# Altium schematic sheet Shutdown.SchDoc
size 381 x 254 mm; SheetNumber: 1; SheetTotal: 1
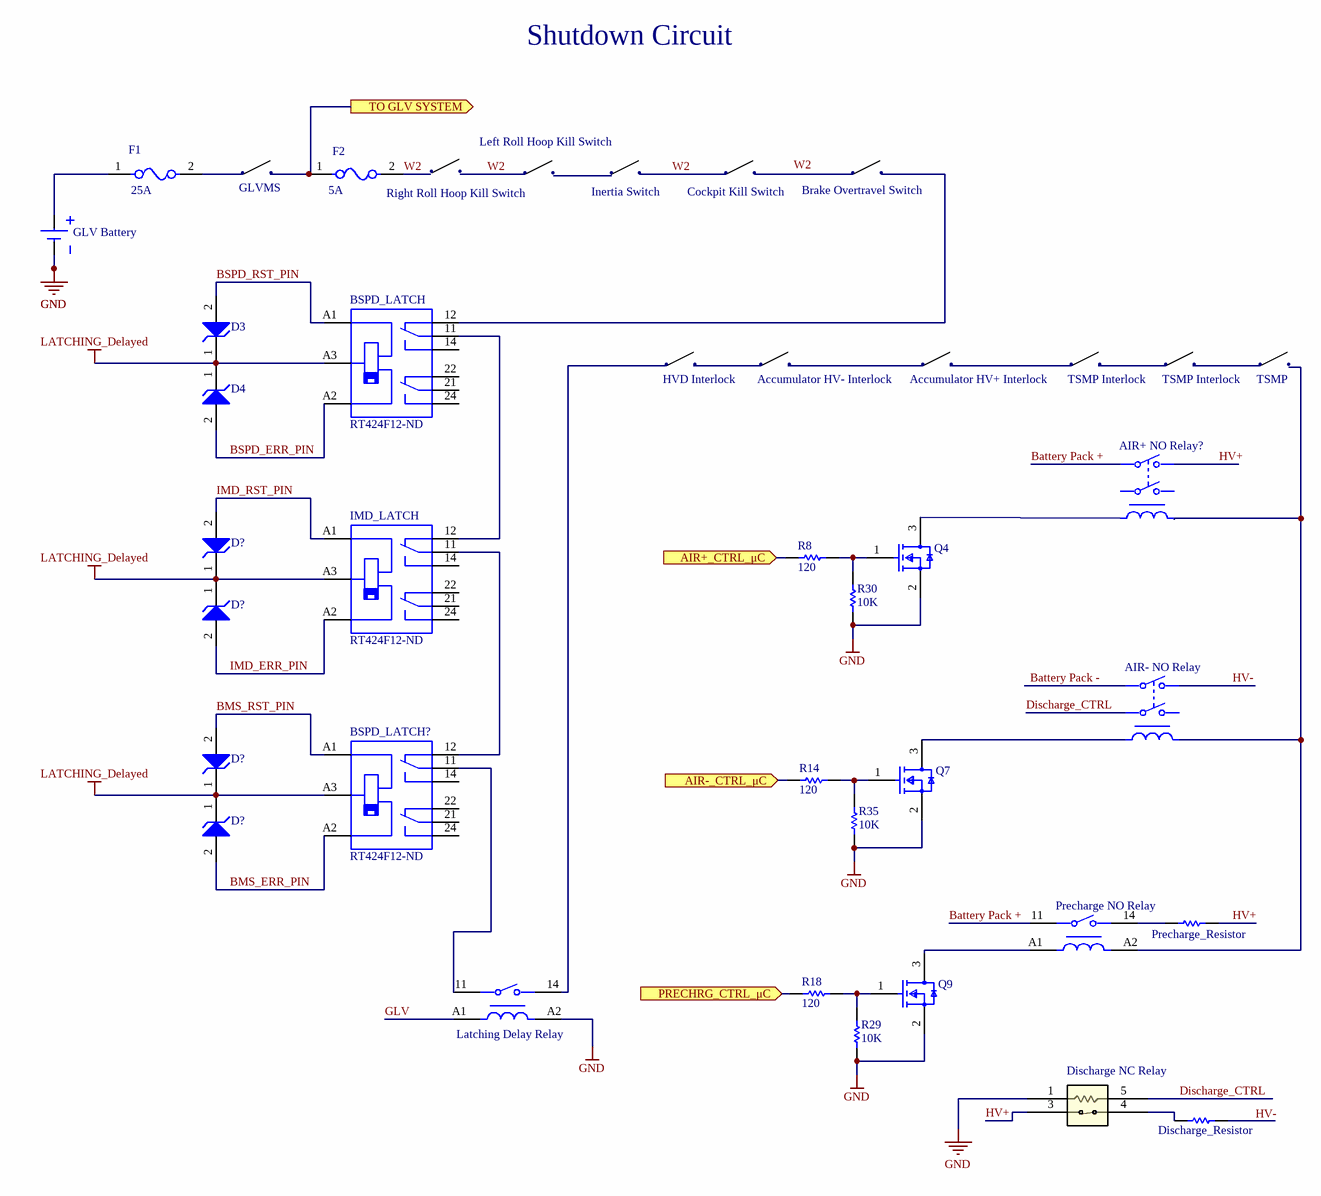
[diagram p0: Shutdown.SchDoc]

## Parts
(Parts that share a designator on the sheet are numbered #1, #2 ... from top to bottom, then left to right.)
?#1  GLVMS
?#2  Right Roll Hoop Kill Switch
?#3  Left Roll Hoop Kill Switch
?#4  Inertia Switch
?#5  Cockpit Kill Switch
?#6  Brake Overtravel Switch
?#7  HVD Interlock
?#8  Accumulator HV- Interlock
?#9  Accumulator HV+ Interlock
?#10  TSMP Interlock
?#11  TSMP Interlock
?#12  TSMP
?#13  Discharge_Resistor  [RESC1005X40X25LL05T05]
AIR+_NO_Relay?  (no value)  [FP-T92S7A22-240-MFG]
AIR-_NO_Relay  (no value)  [FP-T92S7A22-240-MFG]
BSPD_LATCH  RT424F12-ND
BSPD_LATCH?  RT424F12-ND
D3  (no value)  [ONSC-SMB-2-403A-03_H_V]
D4  (no value)  [ONSC-SMB-2-403A-03_H_V]
D?#1  (no value)  [ONSC-SMB-2-403A-03_H_V]
D?#2  (no value)  [ONSC-SMB-2-403A-03_H_V]
D?#3  (no value)  [ONSC-SMB-2-403A-03_H_V]
D?#4  (no value)  [ONSC-SMB-2-403A-03_H_V]
Discharge_NC_Relay  (no value)
F1  25A  [FP-0154-MFG]
F2  5A  [FP-0154-MFG]
GLV_Battery  (no value)  [TECO-120591-1-2_V]
IMD_LATCH  RT424F12-ND
Latching_Delay_Relay  V23092-A1012-A302  [FP-V23092-A1012-A302-MFG]  (value not drawn)
Precharge_NO_Relay  (no value)  [FP-V23092-A1012-A302-MFG]
Precharge_Resistor  (no value)  [RESC1005X40X25LL05T05]
Q4  (no value)  [FP-318-08-IPC_B]
Q7  (no value)  [FP-318-08-IPC_B]
Q9  (no value)  [FP-318-08-IPC_B]
R8  120  [RESC1005X40X25LL05T05]
R14  120  [RESC1005X40X25LL05T05]
R18  120  [RESC1005X40X25LL05T05]
R29  10K  [RESC1005X40X25LL05T05]
R30  10K  [RESC1005X40X25LL05T05]
R35  10K  [RESC1005X40X25LL05T05]

## Ports
AIR+_CTRL_μC (in), AIR-_CTRL_μC (in), PRECHRG_CTRL_μC (in), TO GLV SYSTEM (out)

## Nets
GND: Discharge_NC_Relay.1 GLV_Battery.2(-) Latching_Delay_Relay.A2 Q4.2(S) Q7.2(S) Q9.2(S) R29.1 R30.1 R35.1
LATCHING_Delayed: BSPD_LATCH.A3 BSPD_LATCH?.A3 D3.1(K) D4.1(K) D?#1.1(K) D?#2.1(K) D?#3.1(K) D?#4.1(K) IMD_LATCH.A3
AIR+_CTRL_μC: R8.1 ; port AIR+_CTRL_μC
AIR-_CTRL_μC: R14.1 ; port AIR-_CTRL_μC
Battery Pack +: Precharge_NO_Relay.11
BMS_ERR_PIN: BSPD_LATCH?.A2 D?#4.2(A)
BMS_RST_PIN: BSPD_LATCH?.A1 D?#3.2(A)
BSPD_ERR_PIN: BSPD_LATCH.A2 D4.2(A)
BSPD_RST_PIN: BSPD_LATCH.A1 D3.2(A)
Discharge_CTRL: Discharge_NC_Relay.5
GLV: Latching_Delay_Relay.A1
HV+: Discharge_NC_Relay.3 Precharge_Resistor.2
IMD_ERR_PIN: D?#2.2(A) IMD_LATCH.A2
IMD_RST_PIN: D?#1.2(A) IMD_LATCH.A1
PRECHRG_CTRL_μC: R18.1 ; port PRECHRG_CTRL_μC
TO GLV SYSTEM: F2.1 ; port TO GLV SYSTEM
W2: F2.2
Net?#13_1: ?#13.1 Discharge_NC_Relay.4
NetBSPD_LATCH?_11: BSPD_LATCH?.11 Latching_Delay_Relay.11
NetBSPD_LATCH?_12: BSPD_LATCH?.12 IMD_LATCH.11
NetBSPD_LATCH_11: BSPD_LATCH.11 IMD_LATCH.12
NetF1_1: F1.1 GLV_Battery.1(+)
NetPrecharge_NO_Relay_14: Precharge_NO_Relay.14 Precharge_Resistor.1
NetPrecharge_NO_Relay_A1: Precharge_NO_Relay.A1 Q9.3(D)
NetQ4_1: Q4.1(G) R8.2 R30.2
NetQ7_1: Q7.1(G) R14.2 R35.2
NetQ9_1: Q9.1(G) R18.2 R29.2

Not connected (* = marked no-connect by the designer): ?#13 2; BSPD_LATCH 12 14 21 22 24; BSPD_LATCH? 14 21 22 24; F1 2; IMD_LATCH 14 21 22 24; Latching_Delay_Relay 14; Precharge_NO_Relay A2; Q4 3(D); Q7 3(D)

## Notes on the sheet
- Shutdown Circuit
- Labels drawn without touching a wire or pin: HV-, W2
- (in symbol Component_1) .

## Library data of the parts
?#1-?#12 = Component_1
?#13 Precharge_Resistor R8 R14 R18 R29 R30 R35 = CMP-2000-07451-1: Chip Resistor, 0 Ohm, 0.1 W, -55 to 155 degC, 0402 (1005 Metric), RoHS, Tape and Reel; Manufacturer: Panasonic; Voltage Rating (DC): 50V; Temperature Coefficient: 600ppm/��C; Max Power Dissipation: 100mW; Resistance: 0mOhm; Tolerance: 5%; Number of Terminations: 2; Mount: SurfaceMount; Height: 0.35mm; Packaging: TapeandReel; Contact Plating: Tin; Manufacturer URL: http://www.panasonic.com/; Composition: ThickFilm; Max Operating Temperature: 155degC; REACH SVHC: NoSVHC; Case/Package: 0402; Package Reference: 402; Depth: 0.5mm; Package Description: 2-Pin Surface Mount Device, Body 1 x 0.5 mm; Datasheet URL: https://industrial.panasonic.com/cdbs/www-data/pdf/RDA0000/AOA0000C301.pdf; RoHSCompliant: True; Case Code (Imperial): 0402; Military Standard: Not; Min Operating Temperature: -55degC; Power Rating: 100mW; Datasheet Version: 03/2015; Length: 1mm; Case Code (Metric): 1005; Termination: SMD/SMT; Mounting Technology: SurfaceMount; Voltage Rating: 50V; Width: 0.02inch; Package Quantity: 1; Lead Free: LeadFree; Radiation Hardening: No
AIR+_NO_Relay? AIR-_NO_Relay = CMP-03395-000250-1: RELAY GEN PURPOSE DPST 30A 240V; Operate Time: 15ms; Coil Current: 16.7mA; Coil Power: 4W; Coil Resistance: 3.8kR; Application(s): POWER; Max Voltage Rating (AC): 600V; Relay Type: General Purpose; Contact Voltage Rating (AC): 277V; Approvals: UL; Coil Type: Non-Latching; Contact Current Rating: 30A; Termination: Quick Connect; Length: 2.051inch; Throw Configuration: DPST; RoHS Compliant: Yes; Package Quantity: 30; Max Operating Temperature: 65°C; Power Rating: 4W; Coil Voltage (AC): 240V; Power Consumption: 4W; Voltage Rating (AC): 600V; Weight: 3.034oz; Radiation Hardening: No; Mount: Panel; Series: T92; Lead Free: Lead Free; Number of Pins: 8; Height: 1.039inch; Contact Material: Silver; Current Rating: 30A; Min Operating Temperature: -55°C; Depth: 34.54mm; Release Time: 15ms; Width: 34.5mm; ELV: Non-Compliant; Packaging: Bulk
D3 D4 D?#1-D?#4 = CMP-1060-00222-1: 3 W Zener Voltage Regulator, 2-Pin SMB, Pb-Free, Tape and Reel; Manufacturer: On Semiconductor; PartNumber: 1SMB5920BT3G; VZ Typ (V): 6.2; Packing: Tape and Reel; PackageDescription: 2-Pin Small Molded Package, J-Bend Lead, Body 4.33 x 3.625 mm; Mounting Technology: Surface Mount; PackageVersion: Rev. H, 05/2011; ComponentLink1Description: Manufacturer URL; RoHS: Pb-Free; DatasheetVersion: Rev. 8; ComponentLink2Description: Datasheet; ComponentLink2URL: http://www.onsemi.com/pub_link/Collateral/1SMB5913BT3-D.PDF; ComponentLink1URL: http://www.onsemi.com/; ComponentLink3Description: Package Specification; PackageReference: SMB-2-403A-03_H; ComponentLink3URL: http://www.onsemi.com/pub_link/Collateral/1SMB5913BT3-D.PDF
Discharge_NC_Relay = SPST-NC_Relay
F1 F2 = CMP-08605-000003-1: FUSE BRD MNT 4A 125VAC/VDC 2SMD; Manufacturer Part Number: 0154004.DR; Manufacturer: Littelfuse; Fuse Blow Speed: Fast; Max Fuse Ac Voltage: 125V; Lead Free: Yes; Device Class L3: unset; Device Class L2: Fuses; Package: 0154; ComponentLink2Description: Datasheet; Temperature Range Low: -55°C; Temperature Range High: +125°C; Device Class L1: Circuit Protection; Height: 3.81mm; Temperature: -55°C to +125°C; Mouser Description: Surface Mount Fuses Fuseblock w/ fuse 4A OMNI BLOK 154; Automotive: No; Digikey Description: FUSE BRD MNT 4A 125VAC/VDC 2SMD; RoHS: TRUE; Category: Fuse; Fuse Current: 4A; Max Fuse Dc Voltage: 125V; ComponentLink2URL: https://www.littelfuse.com/~/media/electronics/datasheets/fuses/littelfuse_fuse_154_154t_154l_154tl_datasheet.pdf.pdf; Octopart: https://octopart.com/0154004.dr-littelfuse-565861
GLV_Battery = CMP-0438-00001-2: PartNumber: 120591-1; Manufacturer: TE Connectivity; Packing Type: Tray; Body Shape: Horizontal Cylindrical; AccessRights: 2147483647; RevisionId: 1; Folder: Unified Components\Components\TE Connectivity\Connectors & Connector Components\Power Products\Battery Interconnection Products\; ContentType: Unified Component; ContentTypeGUID: CB3C11C4-E317-11DF-B822-12313F0024A2; ComponentLink1Description: Manufacturer URL; LifeCycleStateGUID: 61E382EE-6656-4F12-9E24-BE9327104A25; FolderGUID: A6761B51-D489-48A3-9180-F4808F45AB79; LifeCycle: Released; ReleaseDate: 20/08/2013 02:50:22 AM; PackageReference: 120591-1; ComponentLink2URL: http://www.te.com/commerce/DocumentDelivery/DDEController?Action=showdoc&DocId=Customer+Drawing%7F120591%7FH%7Fpdf%7FEnglish%7FENG_CD_120591_H.pdf%7F120591-1; DatasheetVersion: Rev. H, 01/2013; PackageDescription: Lithium Battery Holder; ItemGUID: B2C50140-681E-4F62-8DBB-9728605318CE; ItemHRID: CMP-0438-00001; Mounting Technology: Through Hole; ComponentLink1URL: http://www.te.com/; ComponentLink2Description: Datasheet
Latching_Delay_Relay Precharge_NO_Relay = CMP-03395-000267-1: RELAY GEN PURPOSE SPST 6A 12V; Release Time: 5ms; Coil Current: 14.15mA; Coil Power: 170mW; Relay Type: General Purpose; Current Rating: 12A; Ratings: IP67; Operate Time: 12ms; Approvals: UL; Max Voltage Rating (AC): 400V; Coil Type: Non-Latching; Switching Capacity: 1.5kW; Coil Resistance: 848R; Max Current Rating: 10A; Life (Hours): 100000Hour; Min Operating Temperature: -40°C; Case/Package: SIP; Termination: PC Pin; Max Operating Temperature: 85°C; Power Rating: 170mW; Packaging: Rail/Tube; Voltage Rating (DC): 12V; Series: SNR, SCHRACK; Package Quantity: 100; Contact Current Rating: 6A; RoHS Compliant: Yes; Coil Voltage (DC): 12V; Depth: 5mm; Radiation Hardening: No; Throw Configuration: SPST; Contact Material: Tin; Length: 28mm; Width: 5mm; Height: 15mm; Number of Pins: 4; Mount: Through Hole
Q4 Q7 Q9 = CMP-07173-000101-1: MOSFET N-CH 50V 220MA SOT-23; Turn-Off Delay Time: 20ns; Element Configuration: Single; Rds On Max: 3.5R; Gate to Source Voltage (Vgs): 20V; Threshold Voltage: 1.3V; Number of Elements: 1; Power Dissipation: 360mW; Rise Time: 9ns; Turn-On Delay Time: 2.5ns; Input Capacitance: 27pF; On-State Resistance: 6R; Lead Free: Lead Free; Length: 2.92mm; Width: 1.3mm; Drain to Source Breakdown Voltage: 50V; Min Operating Temperature: -55°C; REACH SVHC: No SVHC; Packaging: Tape and Reel; Radiation Hardening: No; Height: 0.93mm; Drain to Source Voltage (Vdss): 50V; Current Rating: 220mA; Voltage Rating (DC): 50V; Weight: 0.03g; Continuous Drain Current (ID): 220mA; Number of Pins: 3; Nominal Vgs: 1.3V; Max Power Dissipation: 360mW; Fall Time: 9ns; Drain to Source Resistance: 3.5R; Contact Plating: Tin; Case/Package: SOT-23; Package Quantity: 1; Dual Supply Voltage: 50V; Mount: Surface Mount; Termination: SMD/SMT; Max Operating Temperature: 150°C